# Altium schematic sheet Connectors.SchDoc
size B; Address1: MILWAUKEE TOOL; Address2: 13135 W. Lisbon Rd.; Address3: Brookfield, WI 53005; SheetNumber: 1; SheetTotal: 1
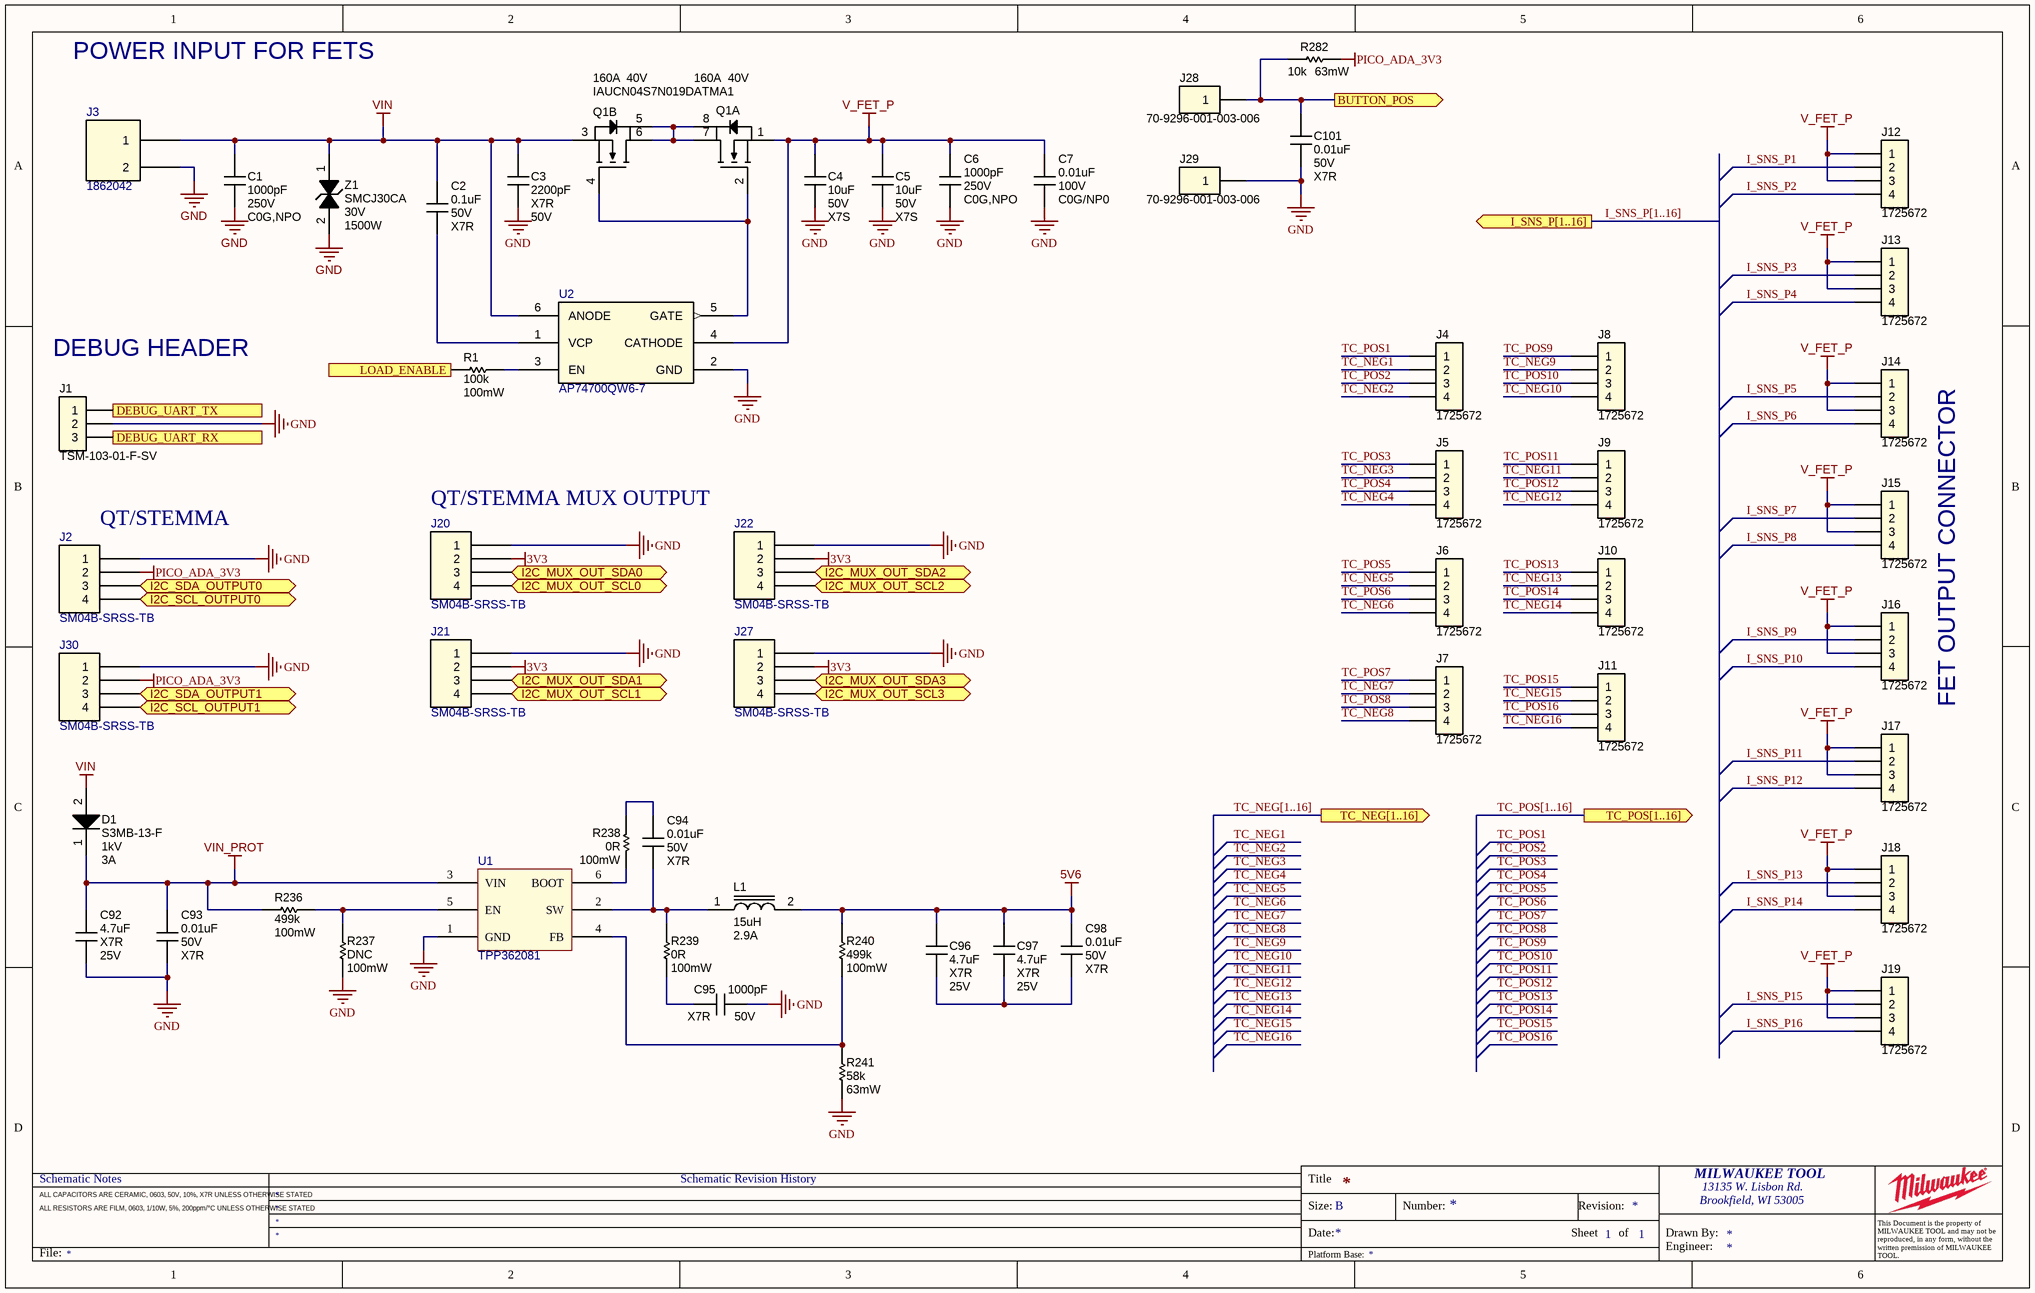
[diagram p0: Connectors.SchDoc]

## Parts
C1  1000pF  Voltage Rating: 250V  Temp Coeff: C0G,NPO  [CAPC1608X09N]
C2  0.1uF  Voltage Rating: 50V  Temp Coeff: X7R  [CAPC1005X06N]
C3  2200pF  Temp Coeff: X7R  Voltage Rating: 50V  [CAPC1608X09N]
C4  10uF  Voltage Rating: 50V  Temp Coeff: X7S  [CAPC3225X28N]
C5  10uF  Voltage Rating: 50V  Temp Coeff: X7S  [CAPC3225X28N]
C6  1000pF  Voltage Rating: 250V  Temp Coeff: C0G,NPO  [CAPC1608X09N]
C7  0.01uF  Voltage Rating: 100V  Temp Coeff: C0G/NP0  [CAPC1608X09N]
C92  4.7uF  Temp Coeff: X7R  Voltage Rating: 25V  [CAPC2012X14N]
C93  0.01uF  Voltage Rating: 50V  Temp Coeff: X7R  [CAPC1608X09N]
C94  0.01uF  Voltage Rating: 50V  Temp Coeff: X7R  [CAPC1608X09N]
C95  1000pF  Temp Coeff: X7R  Voltage Rating: 50V  [CAPC1608X09N]
C96  4.7uF  Temp Coeff: X7R  Voltage Rating: 25V  [CAPC2012X14N]
C97  4.7uF  Temp Coeff: X7R  Voltage Rating: 25V  [CAPC2012X14N]
C98  0.01uF  Voltage Rating: 50V  Temp Coeff: X7R  [CAPC1608X09N]
C101  0.01uF  Voltage Rating: 50V  Temp Coeff: X7R  [CAPC1608X09N]
D1  S3MB-13-F  Voltage Rating: 1kV  Current Rating: 3A  [DIOM4336X25N]
J1  TSM-103-01-F-SV  [CONN_SAMTEC_TSM-103-01-F-SV]
J2  SM04B-SRSS-TB  [CONN_JST_SM04B-SRSS-TB_JST]
J3  1862042  [CONN_PHOENIX_1862042]
J4  1725672  [CONN_PHOENIX_1725672]
J5  1725672  [CONN_PHOENIX_1725672]
J6  1725672  [CONN_PHOENIX_1725672]
J7  1725672  [CONN_PHOENIX_1725672]
J8  1725672  [CONN_PHOENIX_1725672]
J9  1725672  [CONN_PHOENIX_1725672]
J10  1725672  [CONN_PHOENIX_1725672]
J11  1725672  [CONN_PHOENIX_1725672]
J12  1725672  [CONN_PHOENIX_1725672]
J13  1725672  [CONN_PHOENIX_1725672]
J14  1725672  [CONN_PHOENIX_1725672]
J15  1725672  [CONN_PHOENIX_1725672]
J16  1725672  [CONN_PHOENIX_1725672]
J17  1725672  [CONN_PHOENIX_1725672]
J18  1725672  [CONN_PHOENIX_1725672]
J19  1725672  [CONN_PHOENIX_1725672]
J20  SM04B-SRSS-TB  [CONN_JST_SM04B-SRSS-TB_JST]
J21  SM04B-SRSS-TB  [CONN_JST_SM04B-SRSS-TB_JST]
J22  SM04B-SRSS-TB  [CONN_JST_SM04B-SRSS-TB_JST]
J27  SM04B-SRSS-TB  [CONN_JST_SM04B-SRSS-TB_JST]
J28  70-9296-001-003-006  [AVX_709296001003006]
J29  70-9296-001-003-006  [AVX_709296001003006]
J30  SM04B-SRSS-TB  [CONN_JST_SM04B-SRSS-TB_JST]
L1  15uH  Current RAting: 2.9A  [INDM6565X30N]
Q1  Current: 160A  Voltage: 40V  [INF-PG-TDSON-8-61-V]  (hidden comment: IAUCN04S7N019DATMA1)  (parts A,B of 2)
R1  100k  Wattage: 100mW  [RESC1608X06N]
R236  499k  Wattage: 100mW  [RESC1608X06N]
R237  DNC  Wattage: 100mW  [RESC1608X06N]
R238  0R  Wattage: 100mW  [RESC1608X06N]
R239  0R  Wattage: 100mW  [RESC1608X06N]
R240  499k  Wattage: 100mW  [RESC1608X06N]
R241  58k  Wattage: 63mW  [RESC1005X04N]
R282  10k  Wattage: 63mW  [RESC1005X04N]
U1  TPP362081  [SOT95P280X95-6N]
U2  AP74700QW6-7  [SOT95P285X140-6N]
Z1  SMCJ30CA  Voltage: 30V  Wattage: 1500W  [DIOM6959X26N]

## Ports
BUTTON_POS (out), DEBUG_UART_RX (out), DEBUG_UART_TX (in), I2C_MUX_OUT_SCL0 (bidir), I2C_MUX_OUT_SCL1 (bidir), I2C_MUX_OUT_SCL2 (bidir), I2C_MUX_OUT_SCL3 (bidir), I2C_MUX_OUT_SDA0 (bidir), I2C_MUX_OUT_SDA1 (bidir), I2C_MUX_OUT_SDA2 (bidir), I2C_MUX_OUT_SDA3 (bidir), I2C_SCL_OUTPUT0 (bidir), I2C_SCL_OUTPUT1 (bidir), I2C_SDA_OUTPUT0 (bidir), I2C_SDA_OUTPUT1 (bidir), I_SNS_P[1..16] (out), LOAD_ENABLE (in), TC_NEG[1..16] (out), TC_POS[1..16] (out)

## Nets
3V3: J20.2 J21.2 J22.2 J27.2
5V6: C96.1 C97.1 C98.2 L1.2 R240.2
GND: C1.2 C3.2 C4.2 C5.2 C6.2 C7.2 C92.2 C93.1 C95.2 C101.1 J1.2 J2.1 J3.2 J20.1 J21.1 J22.1 J27.1 J29.1 J30.1 R237.2 R241.1 U1.1(GND) U2.2(GND) Z1.2(A)
PICO_ADA_3V3: J2.2 J30.2 R282.2
V_FET_P: C4.1 C5.1 C6.1 C7.1 J12.1 J12.3 J13.1 J13.3 J14.1 J14.3 J15.1 J15.3 J16.1 J16.3 J17.1 J17.3 J18.1 J18.3 J19.1 J19.3 Q1.1(S) U2.4(CATHODE)
VIN: C1.1 C2.1 C3.1 D1.2(Anode) J3.1 Q1.3(S) U2.6(ANODE) Z1.1(K)
VIN_PROT: C92.1 C93.2 D1.1(Cathode) R236.1 U1.3(VIN)
BUTTON_POS: C101.2 J28.1 R282.1 ; port BUTTON_POS
DEBUG_UART_RX: J1.3 ; port DEBUG_UART_RX
DEBUG_UART_TX: J1.1 ; port DEBUG_UART_TX
I2C_MUX_OUT_SCL0: J20.4 ; port I2C_MUX_OUT_SCL0
I2C_MUX_OUT_SCL1: J21.4 ; port I2C_MUX_OUT_SCL1
I2C_MUX_OUT_SCL2: J22.4 ; port I2C_MUX_OUT_SCL2
I2C_MUX_OUT_SCL3: J27.4 ; port I2C_MUX_OUT_SCL3
I2C_MUX_OUT_SDA0: J20.3 ; port I2C_MUX_OUT_SDA0
I2C_MUX_OUT_SDA1: J21.3 ; port I2C_MUX_OUT_SDA1
I2C_MUX_OUT_SDA2: J22.3 ; port I2C_MUX_OUT_SDA2
I2C_MUX_OUT_SDA3: J27.3 ; port I2C_MUX_OUT_SDA3
I2C_SCL_OUTPUT0: J2.4 ; port I2C_SCL_OUTPUT0
I2C_SCL_OUTPUT1: J30.4 ; port I2C_SCL_OUTPUT1
I2C_SDA_OUTPUT0: J2.3 ; port I2C_SDA_OUTPUT0
I2C_SDA_OUTPUT1: J30.3 ; port I2C_SDA_OUTPUT1
I_SNS_P1: J12.2
I_SNS_P2: J12.4
I_SNS_P3: J13.2
I_SNS_P4: J13.4
I_SNS_P5: J14.2
I_SNS_P6: J14.4
I_SNS_P7: J15.2
I_SNS_P8: J15.4
I_SNS_P9: J16.2
I_SNS_P10: J16.4
I_SNS_P11: J17.2
I_SNS_P12: J17.4
I_SNS_P13: J18.2
I_SNS_P14: J18.4
I_SNS_P15: J19.2
I_SNS_P16: J19.4
LOAD_ENABLE: R1.2 ; port LOAD_ENABLE
TC_NEG1: J4.2
TC_NEG2: J4.4
TC_NEG3: J5.2
TC_NEG4: J5.4
TC_NEG5: J6.2
TC_NEG6: J6.4
TC_NEG7: J7.2
TC_NEG8: J7.4
TC_NEG9: J8.2
TC_NEG10: J8.4
TC_NEG11: J9.2
TC_NEG12: J9.4
TC_NEG13: J10.2
TC_NEG14: J10.4
TC_NEG15: J11.2
TC_NEG16: J11.4
TC_POS1: J4.1
TC_POS2: J4.3
TC_POS3: J5.1
TC_POS4: J5.3
TC_POS5: J6.1
TC_POS6: J6.3
TC_POS7: J7.1
TC_POS8: J7.3
TC_POS9: J8.1
TC_POS10: J8.3
TC_POS11: J9.1
TC_POS12: J9.3
TC_POS13: J10.1
TC_POS14: J10.3
TC_POS15: J11.1
TC_POS16: J11.3
NetC2_2: C2.2 U2.1(VCP)
NetC94_1: C94.1 L1.1 R239.2 U1.2(SW)
NetC94_2: C94.2 R238.1
NetC95_1: C95.1 R239.1
NetC96_2: C96.2 C97.2 C98.1
NetQ1_2: Q1.2(G) Q1.4(G) U2.5(GATE)
NetQ1_5: Q1.5(D) Q1.6(D) Q1.7(D) Q1.8(D)
NetR1_1: R1.1 U2.3(EN)
NetR236_2: R236.2 R237.1 U1.5(EN)
NetR238_2: R238.2 U1.6(BOOT)
NetR240_1: R240.1 R241.2 U1.4(FB)

## Buses and harness runs
bus I_SNS_P[1..16] = port I_SNS_P[1..16]
bus TC_NEG[1..16] = port TC_NEG[1..16]
bus TC_POS[1..16] = port TC_POS[1..16]

## Notes on the sheet
- POWER INPUT FOR FETS
- (near J1) DEBUG HEADER
- (near J20) QT/STEMMA MUX OUTPUT
- (near J2) QT/STEMMA
- FET OUTPUT CONNECTOR
- Schematic Notes
- Schematic Revision History
- Title
- ALL CAPACITORS ARE CERAMIC, 0603, 50V, 10%, X7R UNLESS OTHERWISE STATED
- ALL RESISTORS ARE FILM, 0603, 1/10W, 5%, 200ppm/°C UNLESS OTHERWISE STATED
- Size:
- Date:
- B
- Number:
- Sheet
- Revision:
- of
- Drawn By:
- Brookfield, WI 53005
- File:
- Platform Base:
- Engineer:
- This Document is the property of MILWAUKEE TOOL and may not be reproduced, in any form, without the written premission of MILWAUKEE TOOL.

## Library data of the parts
C1 C6 = CMP-004-0013: CAP CER 1000PF 250V X7R 0603; MFR2#: C1608C0G2E102J080AA; MFR: KEMET; MFR#: C0603C102JAGAC7867; Tolerance: 5%; Capacitor Type: Ceramic; Temp Range: -55 / +125 C; Case Code (Imperial): 0603; Value: 1000pF; ComponentLink1Description: Datasheet; ComponentLink1URL: https://api.kemet.com/component-edge/download/datasheet/C0603C102K1RAC7411.pdf; RoHS Compliant: Yes; Design Item ID: CN/1000PF/250V/C0G,NPO/5%/0603; MFR2: TDK Corporation; REACH SVHC: Yes; Case Code (Metric): 1608
C2 = CMP-004-0076: CAP CER SMD 0.1UF 50V X7R 0402; MFR3#: KGM05CR71H104KH; MFR#: GRM155R71H104KE14D; MFR: Murata Electronics; MFR4#: CL05B104KB54PNC; MFR2#: C1005X7R1H104K050BB; Tolerance: 10%; Populate: Yes; Temp Range: -55 / +125 C; Capacitor Type: Ceramic; Case Code (Imperial): 0402; Value: 0.1uF; MFR4: Samsung Electro-Mechanics; Design Item ID: CN/0.1uF/50V/X7R/10%/0402; Case Code (Metric): 1005; ComponentLink1URL: https://search.murata.co.jp/Ceramy/image/img/A01X/G101/ENG/GRM155R71H104KE14-01.pdf; MFR3: KYOCERA AVX; MFR2: TDK Corporation; ComponentLink1Description: Datasheet; RoHS Compliant: Yes; Part Status: Production
C3 = CMP-004-0009: CAP CER 2200PF 50V X7R 0603; MFR2#: CL10B222KB8NFNC; MFR: KEMET; MFR#: C0603C222K5RACAUTO; Tolerance: 10%; Quality: AEC-Q200; Temp Range: -55 / +125 C; Capacitor Type: Ceramic; MFR2: Samsung Electro-Mechanics; Case Code (Metric): 1608; ComponentLink1Description: Datasheet; Value: 2200pF; REACH SVHC: Yes; Case Code (Imperial): 0603; RoHS Compliant: Yes; Design Item ID: CN/2200pF/50V/X7R/10%/0603; ComponentLink1URL: https://api.kemet.com/component-edge/download/datasheet/C0603C473K5RACTU.pdf
C4 C5 = CMP-004-0001: CAP, CER, 10µF, 50V, 10%, X7S, 1210; MFR: TDK Corporation; MFR#: CGA6P3X7S1H106K250AE; Temp Range: -55 / +125 C; Quality: AEC-Q200; Capacitor Type: Ceramic; Design Item ID: CN/10uF/50V/X7S/10%/1210; Case Code (Imperial): 1210; ComponentLink1URL: https://product.tdk.com/info/en/catalog/datasheets/mlcc_automotive_soft_en.pdf?ref_disty=digikey; Case Code (Metric): 3225; ComponentLink1Description: Datasheet; Tolerance: 10%; Value: 10uF; Supplier 1: Avnet; Supplier Part Number 1: CGA6P3X7S1H106K250AE
C7 = CMP-004-0027: CAP CER 1000PF 100V C0G/NP0 0603; MFR: Murata Electronics; MFR#: GCM1885C2A102JA16D; MFR2#: C0603C103K2RECAUTO; Tolerance: 10%; Temp Range: -55 / +125 C; Capacitor Type: Ceramic; RoHS Compliant: Yes; Case Code (Metric): 1608; REACH SVHC: Yes; MFR2: TDK Corporation; Value: 0.01uF; Case Code (Imperial): 0603; Design Item ID: CN/0.01uF/100V/C0G,NP0/10%/0603
C92 C96 C97 = CMP-004-0011: CAP CER 4.7UF 25V X7R 0805; MFR: TDK Corporation; MFR3#: 0805B475K500NT; MFR#: C2012X7R1E475K125AE; MFR2#: CL21B475KAFNNNE; Temp Range: -55 / +125 C; Tolerance: 10%; Capacitor Type: Ceramic; MFR2: Samsung Electro-Mechanics; Case Code (Metric): 2012; REACH SVHC: Yes; ComponentLink1URL: https://search.murata.co.jp/Ceramy/image/img/A01X/G101/ENG/GRM32EC72A106KE05-01.pdf; MFR3: FengHua; Design Item ID: CN/4.7uF/25V/X7R/10%/0805; Value: 4.7uF; RoHS Compliant: Yes; ComponentLink1Description: Datasheet; Case Code (Imperial): 0805
C93 C94 C98 C101 = CMP-004-0069: CAP CER 10000PF (0.01uF) 50V X7R 0603; MFR2#: C0603C103K5RAC7411; MFR#: 06035C103KAT2A; MFR: KYOCERA AVX; Tolerance: 10%; Capacitor Type: Ceramic; Temp Range: -55 / +125 C; Value: 0.01uF; MFR2: KEMET; Case Code (Metric): 1608; Design Item ID: CN/0.01uF/50V/X7R/10%/0603; Case Code (Imperial): 0603; Part Status: Production; Lead Free: *; REACH SVHC: *
C95 = CMP-004-0050: CAP CER 1000PF 50V X7R 0603; MFR: Yageo; MFR2#: 06035C102KAT2A; MFR#: CC0603KRX7R9BB102; Capacitor Type: Ceramic; Temp Range: -55 / +125 C; Tolerance: 10%; Case Code (Metric): 1608; Value: 1000pF; ComponentLink1URL: https://www.yageo.com/upload/media/product/productsearch/datasheet/mlcc/UPY-GPHC_X7R_6.3V-to-50V_18.pdf; Case Code (Imperial): 0603; MFR2: AVX Corporation; ComponentLink1Description: Datasheet; Design Item ID: CN/1000PF/50V/X7R/10%/0603
D1 = CMP-010-0001: DIODE GEN PURP 1KV 3A SMB; MFR: Diodes Incorporated; Current, Non-rep Pk Forward: 100A; Current, Reverse Leakage: 250uA @125 C; Voltage, Forward: 1.15V; Temp Range: -65 / 150 C; Voltage, RMS Max: 700V; Rth(j-c): 10 C/W; MFR#: S3MB-13-F; Value: S3MB-13-F; REACH SVHC: No SVHC; Design Item ID: D/REC/1000V/3A/S3MB-13-F/SMB; RoHS Compliant: Yes
J1 = CMP-007-0021: CONN HEADER SMD 3POS 2.54MM; MFR: Samtec; Gender: Male; Voltage Rating: 475V; Temp Range: -55 / +125 C; Current Rating: 4.1A; System: Connector; Number of Contacts: 3; RoHS Compliant: Yes; Lead Free: Lead Free; Orientation: Straight; Contact Finish: Gold; Flammability Rating: UL94V-0; ComponentLink1URL: https://suddendocs.samtec.com/catalog_english/tsm.pdf; ComponentLink1Description: Catalog Page; Design Item ID: CON/3P/2.54mm/4.1A/TSM-103-01-F-SV/SAMTEC; Terminal Pitch: 2.54mm; MFR#: TSM-103-01-F-SV; Value: TSM-103-01-F-SV
J2 J20-J22 J27 J30 = CMP-007-0084: CONN HEADER SMD R/A SH 4POS 1MM; MFR: JST; Value: SM04B-SRSS-TB; MFR#: SM04B-SRSS-TB; ComponentLink1URL: https://www.jst-mfg.com/product/pdf/eng/eSH.pdf; ComponentLink1Description: Datasheet; Contact Finish: Tin; Type: Connector; Design Item ID: CON/2P/1MM/1A/SM04B-SRSS-TB/JST
J3 = CMP-007-0077: TERM BLOCK 2POS 45DEG 3.5MM PCB; MFR: Phoenix; Value: 1862042; MFR#: 1862042; ComponentLink1URL: https://www.phoenixcontact.com/us/products/1862042/pdf; ComponentLink1Description: Datasheet; Contact Finish: Tin; Type: Connector; Design Item ID: CON/2P/3.5MM/1862042/PHOENIX
J4-J19 = CMP-007-0053: TERM BLK 4P SIDE ENT 2.54MM PCB; MFR: Phoenix Contact; Voltage Rating: 250V AC(RMS)/DC; Current Rating: 6A; System: Connector; Temp Range: -40 / +115 C; Gender: Male; Value: 1725672; Orientation: Right Angle; Terminal Pitch: 2.54mm; Design Item ID: CON/4P/2.54mm/6A/1725672/PHOENIX_CONTACT; Flammability Rating: UL 94V0; MFR#: 1725672; Contact Finish: Tin; ComponentLink1Description: Datasheet; ComponentLink1URL: https://www.phoenixcontact.com/en-us/products/printed-circuit-board-terminal-mpt-05-4-254-1725672
J28 J29 = CMP-007-0008: CONN SSL POKE-IN CONT 18-26AWG; MFR: AVX; System: Connector; Value: 709296001003006; Voltage Rating: 300V; Temp Range: -40 / +125 C; Current Rating: 15A - 7A (18-26AWG); Gender: Female; Design Item ID: CON/1P/POKE/15A-70-9296-001-003-006/AVX; ComponentLink1URL: https://datasheets.avx.com/Poke_Home_Single_70-9296.pdf; Part Status: Production; Orientation: Right Angle; ComponentLink1Description: Datasheet; Terminal Pitch: n/a; MFR#: 709296001003006; Wire Gauge: 18 - 26 AWG
L1 = CMP-018-0005: FIXED IND 15UH 2.9A 127 MOHM SMD; MFR: Vishay Dale; MFR#: IHLP2525CZER150M8A; Current, Saturation: 2.8A; Inductor Type: GENERAL PURPOSE INDUCTOR; Voltage Rating: 75V; DCR: 127 mOhm MAX; Quality: AEC-Q200; Self Resonant Frequency: 11 MHz; Temp Range: -55 / +180 C; Tolerance: 20%; Value: 15uH; Design Item ID: L/15uH/127/2.9A/20%/IHLP2525CZ; ComponentLink1URL: https://www.vishay.com/docs/34362/lp25cz8a.pdf; RoHS Compliant: Yes; ComponentLink1Description: Datasheet; REACH SVHC: Yes
Q1 = CMP-029-0048: TRANS DUAL MOSFET N-CH 40V 160A PG-TDSON-8-60; MFR: Infineon; Rth(j-c): 1.6 C/W; Wattage: 96W; Rth(j-a): 46 C/W; Transistor Type: NCH; Populate: Yes; Temp Range, Junction: -55 / +175 C; Design Item ID: Q/NCH/D/40V/160A/IAUCN04S7N019DATMA1/8tdson; MFR#: IAUCN04S7N019DATMA1; Case/Package: PG-TDSON-8; REACH SVHC: No SVHC; Value: IAUCN04S7N019DATMA1; RoHS Compliant: Yes; Part Status: Production; ComponentLink1URL: https://www.infineon.com/assets/row/public/documents/10/49/infineon-iaucn04s7n019d-datasheet-en.pdf?fileId=8ac78c8c92416ca501927583b6c81041; ComponentLink1Description: Datasheet; Temp Range, Ambient: -55 / +175 C
R1 = CMP-025-0099: RES SMD 100K OHM 1% 1/10W 0603; MFR3#: CRGCQ0603F100K; MFR: Panasonic Electronic Components; MFR4#: RS-03K1003FT; MFR#: ERJ-3EKF1003V; MFR2#: RMCF0603FT100K; Voltage: 75V; Temp Range: -55 / +155 C; Quality: AEC-Q200; Current: 1A; Value: 100k; Resistor Type: Thick Film; ComponentLink1URL: https://industrial.panasonic.com/cdbs/www-data/pdf/RDA0000/AOA0000C304.pdf; ComponentLink1Description: Datasheet; Tolerance: 1%; Case Code (Metric): 1608; MFR4: FengHua; MFR3: TE Connectivity; Design Item ID: R/100.0K/0.1W/1%/0603; Case Code (Imperial): 0603; MFR2: Stackpole Electronics Inc
R236 R240 = CMP-025-0006: RES SMD 499k OHM 1% 1/10W 0603; MFR: Panasonic Electronic Components; MFR#: ERJ-3EKF4993V; MFR2#: RMCF0603FT499K; Voltage Rating: 75V; Quality: AEC-Q200; Current: 1A; Temp Range: -55 / +155 C; Temperature Coefficient: 100ppm/°C; MFR2: Stackpole Electronics Inc; ComponentLink1URL: https://industrial.panasonic.com/cdbs/www-data/pdf/RDA0000/AOA0000C304.pdf; Value: 499k Ohm; Resistor Type: Thick Film; Case Code (Metric): 1608; REACH SVHC: Yes; Design Item ID: R/499K/0.1W/1%/0603; ComponentLink1Description: Datasheet; Case Code (Imperial): 0603; Tolerance: 1%; RoHS Compliant: Yes
R237-R239 = CMP-025-0103: RES SMD 0 OHM JUMPER 1/10W 0603; MFR#: ERJ-3GEY0R00V; MFR2#: RMCF0603ZT0R00; MFR: Panasonic Electronic Components; MFR3#: RK73Z1JTBK; MFR4#: RC0603JR-070RL; Voltage: 75V; Value: 0 ohm; Current: 1A; Quality: AEC-Q200; Temp Range: -55 / +155 C; MFR4: YAGEO; ComponentLink1Description: Datasheet; MFR3: KOA Speer Electronics; RoHS Compliant: Yes; ComponentLink1URL: https://industrial.panasonic.com/cdbs/www-data/pdf/RDA0000/AOA0000C301.pdf; Tolerance: Jumper; Resistor Type: Thick Film; Design Item ID: R/0.00/0.1W/JUMPER/0603; MFR2: Stackpole Electronics Inc
R241 = CMP-025-0175: RES SMD 58K OHM 1% 1/16W 0402; MFR#: RC0402FR-0759KL; MFR: Yageo; Value: 58k Ohm; Temp Range: -55 / +155 C; Temperature Coefficient: 50 ppm/°C; Populate: Yes; Tolerance: 1%; ComponentLink1Description: Datasheet; ComponentLink1URL: https://yageogroup.com/content/datasheet/asset/file/PYU-RC_GROUP_51_ROHS_L; Resistor Type: Thick Film; Case Code (Imperial): 0402; Case Code (Metric): 1005; Design Item ID: R/58K/0.063W/1%/0402; RoHS Compliant: Yes; Part Status: Production
R282 = CMP-025-0026: RES SMD 10K OHM 0.5% 1/16W 0402; MFR2#: RNCF0402DTE10K0; MFR#: ERA-2AED103X; MFR: Panasonic Electronic Components; Temp Range: -55 / +155 C; Voltage Rating: 50V; Temperature Coefficient: 25ppm/°C; Quality: AEC-Q200; MFR2: Stackpole Electronics Inc; RoHS Compliant: Yes; ComponentLink1Description: Datasheet; REACH SVHC: Yes; Value: 10k; Case Code (Imperial): 0402; Case Code (Metric): 1005; Tolerance: 0.5%; Resistor Type: Thick Film; Design Item ID: R/10.0K/0.063W/0.5%/0402; ComponentLink1URL: https://industrial.panasonic.com/cdbs/www-data/pdf/RDM0000/AOA0000C307.pdf
U1 = CMP-017-0119: IC OPAMP VFB 1 CIRCUIT 8HVSSOP; MFR: 3PEAK; MFR#: TPP362081-T6TR; Populate: Yes; REACFH SVCH: Unaffected; Temp Range, Ambient: -40 / +85 C; Voltage Range, Input: 4.5V - 36V DC; Temp Range, Junction: -40 / +150C; Voltage Rating, Output: 0.6V - 36V DC; Value: TPP362081-T6TR; Design Item ID: IC/VREG/TPP362081/SOT23-6; Part Status: Production; RoHS Comliant: Yes; Type: DC/DC; ComponentLink1Description: Datasheet; ComponentLink1URL: https://static.3peak.com/res/doc/ds/Datasheet_TPP36208.pdf
U2 = CMP-017-0114: IC LOAD SWITCH SOT26 T&R 3K; MFR: Diodes Inc; Populate: Yes; REACFH SVCH: Unaffected; Temp Range, Ambient: -40 / +85 C; Voltage Range: -60 / +60 V; Temp Range, Junction: -40 / +150C; Value: AP74700QW6-7; MFR#: AP74700QW6-7; Case Package: SOT23-6; Design Item ID: IC/LSW/AP74700QW6-7/SOT23-6; Part Status: Production; RoHS Comliant: Yes; Type: LOAD SWITCH; ComponentLink1Description: Datasheet; ComponentLink1URL: https://www.diodes.com/assets/Datasheets/AP74700Q.pdf
Z1 = CMP-014-0007: TVS DIODE 30VWM 48.4VC DO214AB; MFR#: SMCJ30CA-TP; MFR: Micro Commercial Co; Temp Range: -55 / +150 C; Voltage, Clamping: 48.4V; Current: 31A; Design Item ID: TVSB/1500W/30V/SMCJ30CA/SMC; MFR2#: SMCJ30CA; Value: SMCJ30CA; Part Status: Production; MFR2: Littelfuse Inc.